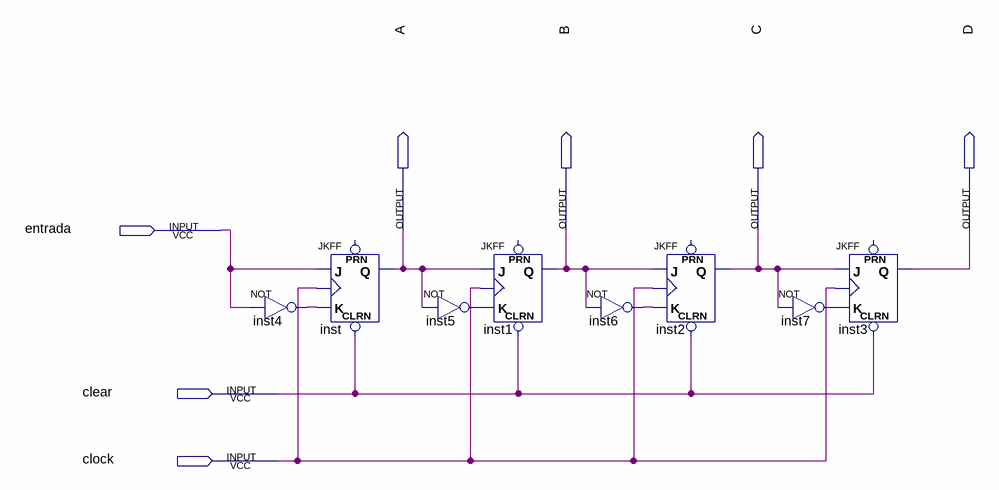
[diagram p0: schematic sheet]
// Quartus schematic paralell_serial.bdf as structural Verilog: 8 symbols, 7 pins
module paralell_serial (
  input  entrada,
  input  clear,
  input  clock,
  output A,
  output B,
  output C,
  output D
);

  wire inst4_out, inst5_out, inst6_out, inst7_out;

  not inst4 (inst4_out, entrada);
  JKFF inst (.CLRN(clear), .K(inst4_out), .J(entrada), .CLK(clock), .Q(A));  // open: PRN
  not inst5 (inst5_out, A);
  JKFF inst1 (.CLRN(clear), .K(inst5_out), .J(A), .CLK(clock), .Q(B));  // open: PRN
  not inst6 (inst6_out, B);
  JKFF inst2 (.CLRN(clear), .K(inst6_out), .J(B), .CLK(clock), .Q(C));  // open: PRN
  JKFF inst3 (.CLRN(clear), .K(inst7_out), .J(C), .CLK(clock), .Q(D));  // open: PRN
  not inst7 (inst7_out, C);
endmodule
